# Altium schematic sheet Peripherals.SchDoc: z80 Single Board Computer: Peripherals
size A4; DrawnBy: Naoki Pross; SheetNumber: 2; SheetTotal: 4
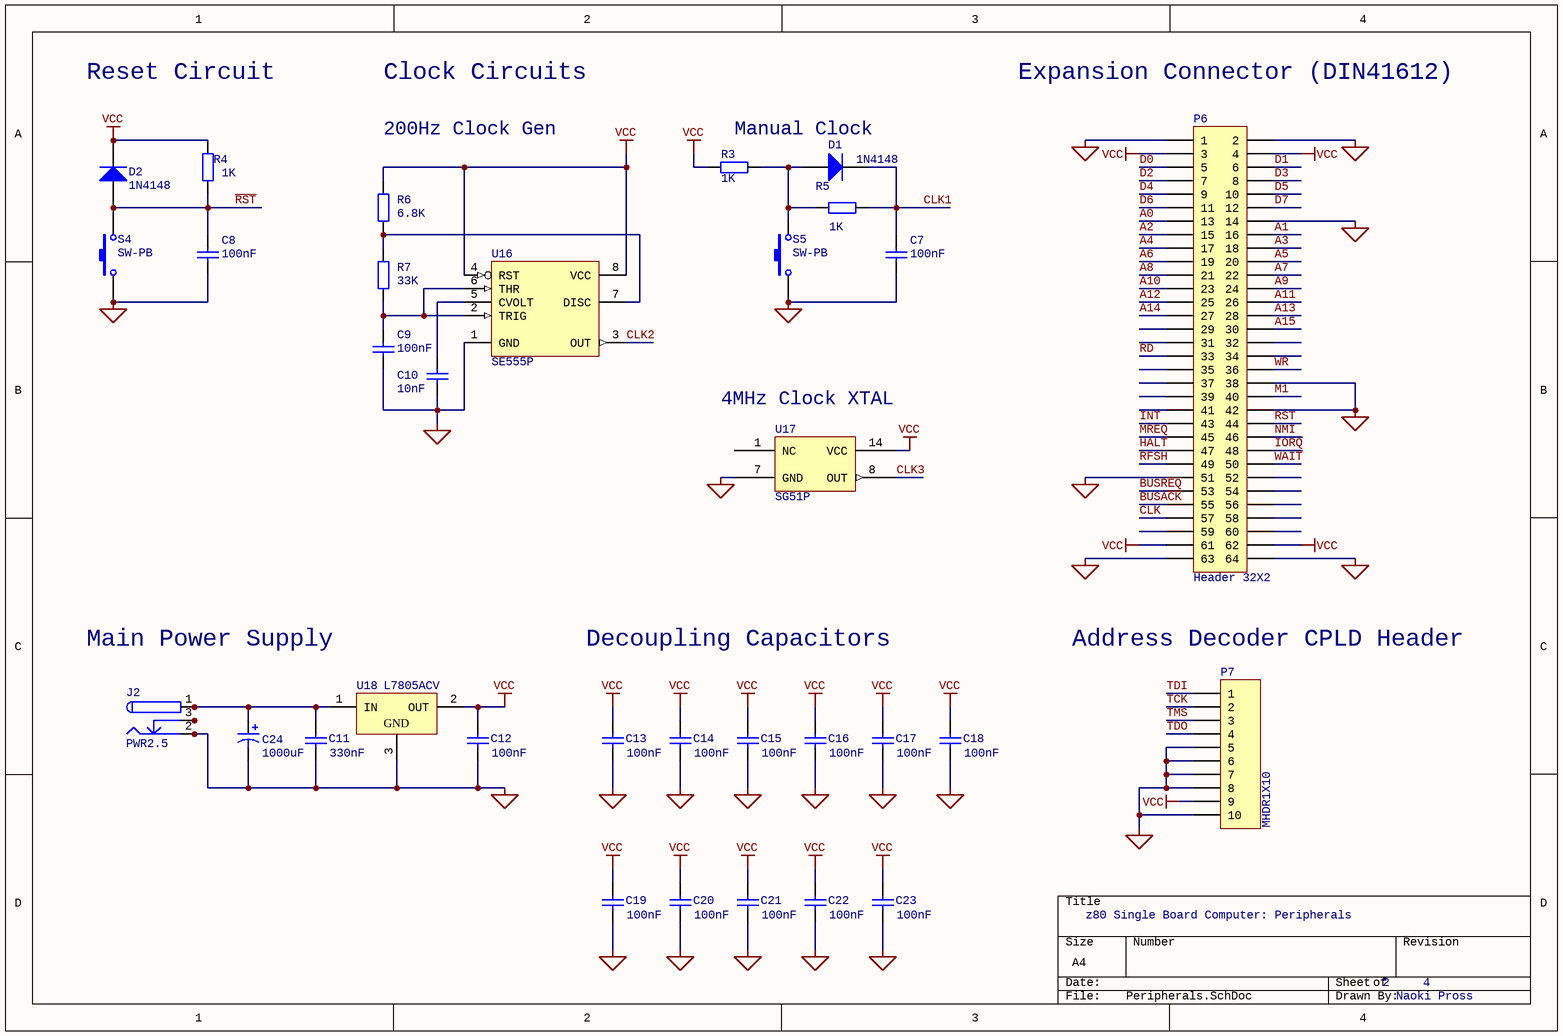
[diagram p0: Peripherals.SchDoc]

## Parts
C7  value 100nF  [RAD-0.1]  (hidden comment: Cap)
C8  value 100nF  [RAD-0.1]  (hidden comment: Cap)
C9  value 100nF  [RAD-0.1]  (hidden comment: Cap)
C10  value 10nF  [RAD-0.4]  (hidden comment: Cap)
C11  value 330nF  [RAD-0.3]  (hidden comment: Cap)
C12  value 100nF  [RAD-0.1]  (hidden comment: Cap)
C13  value 100nF  [RAD-0.1]  (hidden comment: Cap)
C14  value 100nF  [RAD-0.1]  (hidden comment: Cap)
C15  value 100nF  [RAD-0.1]  (hidden comment: Cap)
C16  value 100nF  [RAD-0.1]  (hidden comment: Cap)
C17  value 100nF  [RAD-0.1]  (hidden comment: Cap)
C18  value 100nF  [RAD-0.1]  (hidden comment: Cap)
C19  value 100nF  [RAD-0.1]  (hidden comment: Cap)
C20  value 100nF  [RAD-0.1]  (hidden comment: Cap)
C21  value 100nF  [RAD-0.1]  (hidden comment: Cap)
C22  value 100nF  [RAD-0.1]  (hidden comment: Cap)
C23  value 100nF  [RAD-0.1]  (hidden comment: Cap)
C24  value 1000uF  [RB5-10.5]  (hidden comment: Cap Pol1)
D1  1N4148  [DO-35]
D2  1N4148  [DO-35]
J2  PWR2.5  [KLD-0202]
P6  Header 32X2  [0973264X804]
P7  MHDR1X10  [HDR5x2_SOCK]
R3  value 1K  [AXIAL-0.4]  (hidden comment: Res2)
R4  value 1K  [AXIAL-0.4]  (hidden comment: Res2)
R5  value 1K  [AXIAL-0.4]  (hidden comment: Res2)
R6  value 6.8K  [AXIAL-0.4]  (hidden comment: Res2)
R7  value 33K  [AXIAL-0.4]  (hidden comment: Res2)
S4  SW-PB  [DPST-4]
S5  SW-PB  [DPST-4]
U16  SE555P  [P008]
U17  SG51P  [DIP14]
U18  L7805ACV  [TO220ABN]

## Nets
GND: C7.1 C8.1 C9.1 C10.1 C11.1 C12.1 C13.1 C14.1 C15.1 C16.1 C17.1 C18.1 C19.1 C20.1 C21.1 C22.1 C23.1 C24.2 J2.2 J2.2A J2.2B P6.1 P6.2 P6.14 P6.38 P6.42 P6.51 P6.63 P6.64 P7.5 P7.6 P7.7 P7.8 P7.10 S4.1 S5.1 U16.1(GND) U17.7(GND) U18.3(GND)
VCC: C12.2 C13.2 C14.2 C15.2 C16.2 C17.2 C18.2 C19.2 C20.2 C21.2 C22.2 C23.2 D2.2(K) P6.3 P6.4 P6.61 P6.62 P7.9 R3.2 R4.2 R6.2 U16.4(RST) U16.8(VCC) U17.14(VCC) U18.2(OUT)
A0: P6.13
A1: P6.16
A2: P6.15
A3: P6.18
A4: P6.17
A5: P6.20
A6: P6.19
A7: P6.22
A8: P6.21
A9: P6.24
A10: P6.23
A11: P6.26
A12: P6.25
A13: P6.28
A14: P6.27
A15: P6.30
~{BUSACK}: P6.55
~{BUSREQ}: P6.53
CLK: P6.57
CLK1: C7.2 D1.2(K) R5.2
CLK2: U16.3(OUT)
CLK3: U17.8(OUT)
D0: P6.5
D1: P6.6
D2: P6.7
D3: P6.8
D4: P6.9
D5: P6.10
D6: P6.11
D7: P6.12
~{HALT}: P6.47
~{INT}: P6.43
~{IORQ}: P6.48
~{M1}: P6.40
~{MREQ}: P6.45
NMI: P6.46
~{RD}: P6.33
~{RFSH}: P6.49
~{RST}: C8.2 D2.1(A) P6.44 R4.1 S4.2
TCK: P7.2
TDI: P7.1
TDO: P7.4
TMS: P7.3
~{WAIT}: P6.50
~{WR}: P6.36
NetC9_2: C9.2 R7.1 U16.2(TRIG) U16.6(THR)
NetC10_2: C10.2 U16.5(CVOLT)
NetC11_2: C11.2 C24.1 J2.1 J2.1A J2.1B U18.1(IN)
NetD1_1: D1.1(A) R3.1 R5.1 S5.2
NetJ2_3: J2.3 J2.3A J2.3B
NetR6_1: R6.1 R7.2 U16.7(DISC)

Not connected (* = marked no-connect by the designer): P6 29 31 32 34 35 37 39 41 52 54 56 58 59 60; U17 1(NC)

## Notes on the sheet
- Reset Circuit
- Clock Circuits
- Expansion Connector (DIN41612)
- 200Hz Clock Gen
- Manual Clock
- (near U17) 4MHz Clock XTAL
- Main Power Supply
- Decoupling Capacitors
- (near P7) Address Decoder CPLD Header

## Library data of the parts
C7-C23 = Cap: Capacitor; Published: 8-Jun-2000; LatestRevisionDate: 17-Jul-2002; LatestRevisionNote: Re-released for DXP Platform.; PackageReference: RAD-0.3; Publisher: Altium Limited; PackageDescription: Radial Cap, Thru-Hole; 2 Leads; 0.3 in Pin Spacing
C24 = Cap Pol1: Polarized Capacitor (Radial); Published: 8-Jun-2000; LatestRevisionDate: 17-Jul-2002; LatestRevisionNote: Re-released for DXP Platform.; PackageReference: RB7.6-15; Publisher: Altium Limited; PackageDescription: Polarized Capacitor (Radial); 2 Leads
D1 D2 = Diode 1N4148: High Conductance Fast Diode; Published: 8-Jun-2000; LatestRevisionDate: 17-Jul-2002; LatestRevisionNote: Re-released for DXP Platform.; DatasheetVersion: 1997; PackageReference: DO-35; Publisher: Altium Limited; PackageDescription: Diode, Axial; Body 3.8 x 1.9 mm (LxDia. max), Lead Dia. 0.53 mm (max); Code_JEDEC: DO-204-AH; ComponentLink1Description: Manufacturer Link; ComponentLink1URL: http://www.fairchildsemi.com/; ComponentLink2Description: Datasheet; ComponentLink2URL: http://www.fairchildsemi.com/ds/1N%2F1N4148.pdf
J2 = PWR2.5: Low Voltage Power Supply Connector; pin to pad: 1A>1 1B>1 2A>2 2B>2 3A>3 3B>3; Published: 17-Dec-2003; DatasheetDocument: 09-May-2002; Publisher: Altium Limited; ComponentLink1Description: Manufacturer Link; ComponentLink1URL: http://domino.kycon.com/internet/Products.html
P6 = Header 32X2: Header, 32-Pin, Dual row; pin to pad: 1>C1 2>A1 3>C2 4>A2 5>C3 6>A3 7>C4 8>A4 9>C5 10>A5 11>C6 12>A6 13>C7 14>A7 15>C8 16>A8 17>C9 18>A9 19>C10 20>A10 21>C11 22>A11 23>C12 24>A12 25>C13 26>A13 27>C14 28>A14 29>C15 30>A15 31>C16 32>A16 33>C17 34>A17 35>C18 36>A18 37>C19 38>A19 39>C20 40>A20 41>C21 42>A21 43>C22 44>A22 45>C23 46>A23 47>C24 48>A24 49>C25 50>A25 51>C26 52>A26 53>C27 54>A27 55>C28 56>A28 57>C29 58>A29 59>C30 60>A30 61>C31 62>A31 63>C32 64>A32; LatestRevisionDate: 17-Jul-2002; LatestRevisionNote: Re-released for DXP Platform.; Publisher: Altium Limited
P7 = MHDR1X10: Header, 10-Pin; LatestRevisionDate: 17-Jul-2002; LatestRevisionNote: Re-released for DXP Platform.; Publisher: Altium Limited
R3-R7 = Res2: Resistor; Published: 8-Jun-2000; LatestRevisionDate: 17-Jul-2002; LatestRevisionNote: Re-released for DXP Platform.; PackageReference: AXIAL-0.4; Publisher: Altium Limited; PackageDescription: Axial Device, Thru-Hole; 2 Leads; 0.4 in Pin Spacing
S4 S5 = SW-PB: Switch; Published: 24-Mar-1999; LatestRevisionDate: 17-Jul-2002; LatestRevisionNote: Re-released for DXP Platform.; PackageReference: SPST-2; Publisher: Altium Limited; PackageDescription: Switch; 2 Leads
U16 = SE555P: Precision Timer; Published: 16-Jan-2001; LatestRevisionDate: 04-Mar-2005; LatestRevisionNote: Stylized 3D Model Added.; DatasheetVersion: Feb-1992; PackageVersion: Jun-1999; PackageReference: P008; Publisher: Altium Limited; PackageDescription: DIP; 8 Leads; Row Spacing 7.62 mm; Pitch 2.54 mm; Code_JEDEC: MO-001-AN; ComponentLink1Description: Manufacturer Link; ComponentLink1URL: http://www.ti.com/; ComponentLink2Description: Datasheet; ComponentLink2URL: http://www-s.ti.com/sc/ds/se555.pdf
U17 = SG51P: 4.000000  MHz High Frequency Oscillator
U18 = L7805ACV: Precision 1A Regulator; Note: Tab is connected to pin 3 (GND).; Published: 24-Aug-2001; LatestRevisionDate: 17-Jul-2002; LatestRevisionNote: Re-released for DXP Platform.; DatasheetVersion: Nov-1999; PackageVersion: Jun-1998; PackageReference: TO220ABN; Publisher: Altium Limited; PackageDescription: TO, Thru-Hole, Vertical, Heatsink Mounted; 3 In-Line Leads; Pitch 2.54 mm; Pin sequence 1, 3, 2; ComponentLink1Description: Manufacturer Link; ComponentLink1URL: http://www.st.com/; ComponentLink2Description: Datasheet; ComponentLink2URL: http://www.st.com/stonline/products/literature/ds/2144/l7805ab.pdf